# Altium schematic sheet Schematic R1.SchDoc
size A3
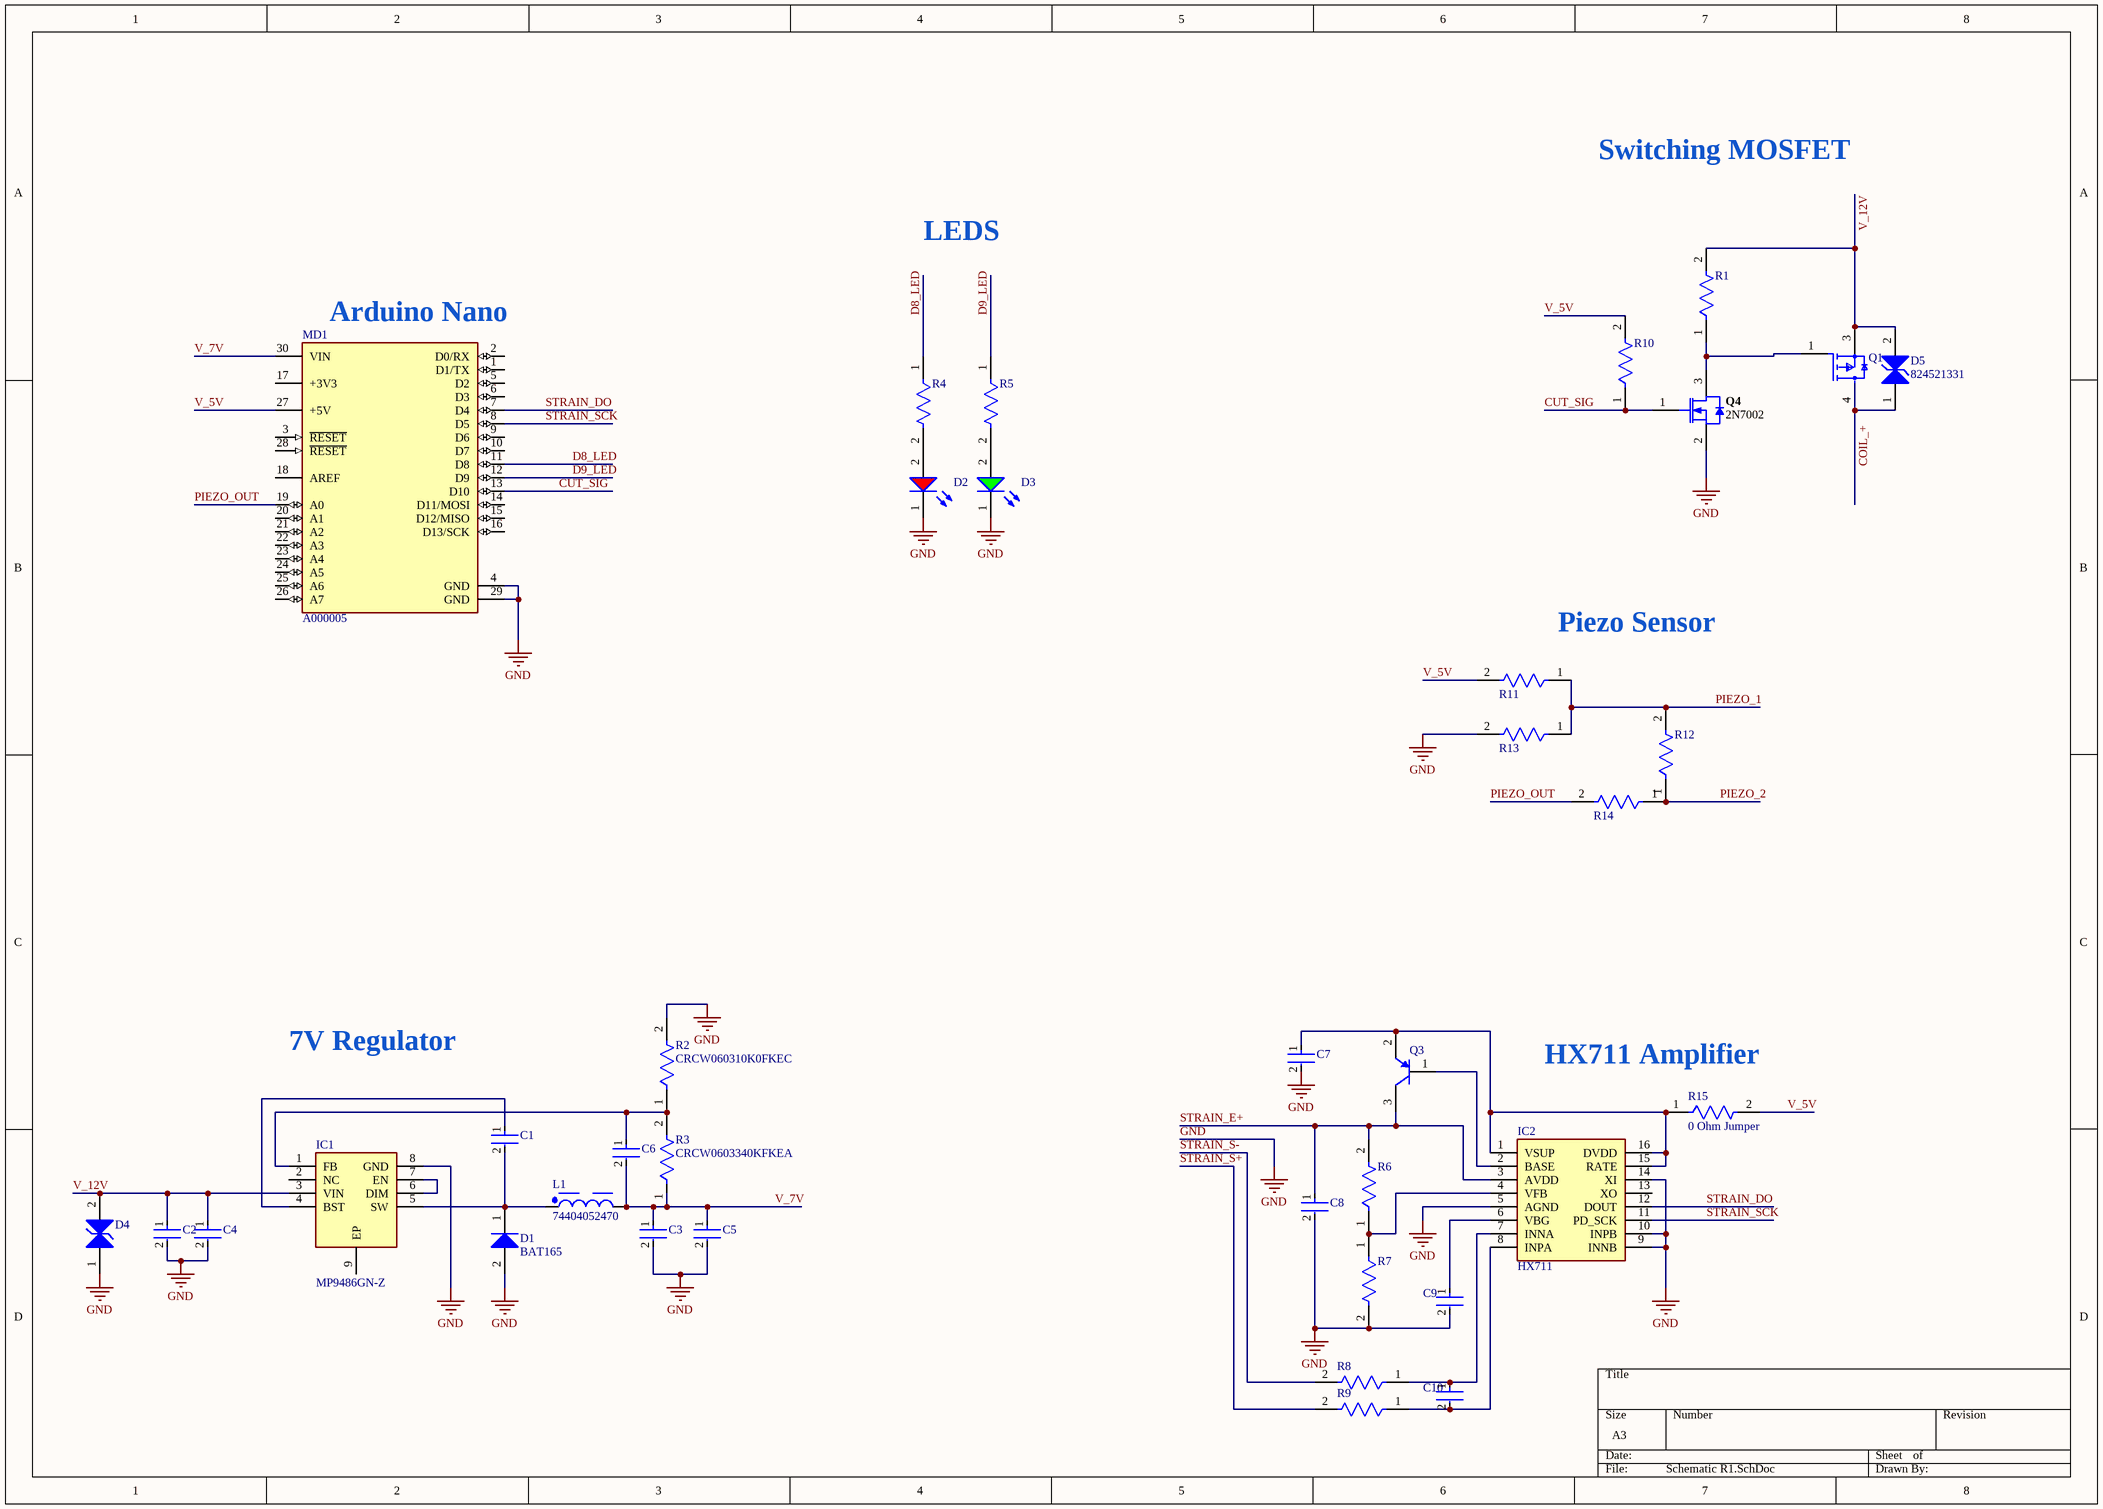
[diagram p0: Schematic R1.SchDoc]

## Parts
C1  C0603C104K3PACTU  [FP-C0603C-CF-MFG]  (value not drawn)
C2  C3216X5R1E476M160AC  [FP-C3216-160-0_2-MFG]  (value not drawn)
C3  C3216X5R1E476M160AC  [FP-C3216-160-0_2-MFG]  (value not drawn)
C4  C0603C104K3PACTU  [FP-C0603C-CF-MFG]  (value not drawn)
C5  C0603C225K4PACTU  [FP-C0603C225K4PACTU-MFG]  (value not drawn)
C6  C0603C104K3PACTU  [FP-C0603C-CF-MFG]  (value not drawn)
C7  C0603C106M8PACTU  [FP-C0603C106M8PACTU-MFG]  (value not drawn)
C8  C0603C106M8PACTU  [FP-C0603C106M8PACTU-MFG]  (value not drawn)
C9  C0603C104K3PACTU  [FP-C0603C-CF-MFG]  (value not drawn)
C10  C0603C104K3PACTU  [FP-C0603C-CF-MFG]  (value not drawn)
D1  BAT165  [INF-SOD323_V]
D2  150080RS75000  [WL-SMCW_0805_150080xx75000]  (value not drawn)
D3  150080GS75000  [WL-SMCW_0805_150080xx75000]  (value not drawn)
D4  824521331  [WE-TVSP_DO-214AA_Bidirectional]  (value not drawn)
D5  824521331  [WE-TVSP_DO-214AA_Bidirectional]
IC1  MP9486GN-Z  [SOIC127P600X170-9N]
IC2  HX711  [SOIC127P600X160-16N]
L1  74404052470  [WE-LQS_5020]
MD1  A000005  [FP-A000005-MFG]
Q1  SQM120P06-07L_GE3  [FP-T13-0707-MFG]  (value not drawn)
Q3  MMBT4403LT1G  [ONSC-SOT-23-3-318-08_V]  (value not drawn)
Q4  2N7002  [INF-PG-SOT23_M]
R1  CRCW060310K0FKEC  [FP-CRCW0603-e3-IPC_A]  (value not drawn)
R2  CRCW060310K0FKEC  [FP-CRCW0603-e3-IPC_A]
R3  CRCW0603340KFKEA  [FP-CRCW0603-e3-IPC_C]
R4  CRCW0603470RFKEA  [FP-CRCW0603-e3-MFG]  (value not drawn)
R5  CRCW0603470RFKEA  [FP-CRCW0603-e3-MFG]  (value not drawn)
R6  CRCW060310K0FKEC  [FP-CRCW0603-e3-IPC_A]  (value not drawn)
R7  CRCW06038K20FKEC  [FP-CRCW0603-e3-IPC_B]  (value not drawn)
R8  CRCW0603100RFKEB  [FP-CRCW0603-e3-IPC_A]  (value not drawn)
R9  CRCW0603100RFKEB  [FP-CRCW0603-e3-IPC_A]  (value not drawn)
R10  CRCW060310K0FKEC  [FP-CRCW0603-e3-IPC_A]  (value not drawn)
R11  CRCW060310K0FKEC  [FP-CRCW0603-e3-IPC_A]  (value not drawn)
R12  CRCW060310M0JNEA  [FP-CRCW0603-e3-IPC_A]  (value not drawn)
R13  CRCW060310K0FKEC  [FP-CRCW0603-e3-IPC_A]  (value not drawn)
R14  CRCW060310K0FKEC  [FP-CRCW0603-e3-IPC_A]  (value not drawn)
R15  0 Ohm Jumper  [FP-CRCW0603-HPe3-IPC_B]

## Nets
GND: C2.2 C3.2 C4.2 C5.2 C7.2 C8.2 C9.2 D1.2(A) D2.1(K) D3.1(K) D4.1 IC1.8(GND) IC2.5(AGND) IC2.9(INNB) IC2.10(INPB) IC2.14(XI) MD1.4(GND) MD1.29(GND) Q4.2(SOURCE) R2.2 R7.2 R13.2
COIL_+: D5.1 Q1.4(D)
CUT_SIG: MD1.13(D10) Q4.1(GATE) R10.1
D8_LED: MD1.11(D8) R4.1
D9_LED: MD1.12(D9) R5.1
PIEZO_1: R11.1 R12.2 R13.1
PIEZO_2: R12.1 R14.1
PIEZO_OUT: MD1.19(A0) R14.2
STRAIN_DO: IC2.12(DOUT) MD1.7(D4)
STRAIN_E+: C8.1 IC2.3(AVDD) Q3.3(C) R6.2
STRAIN_S+: R9.2
STRAIN_S-: R8.2
STRAIN_SCK: IC2.11(PD_SCK) MD1.8(D5)
V_5V: MD1.27(+5V) R10.2 R11.2 R15.2
V_7V: C3.1 C5.1 C6.2 L1.2 MD1.30(VIN) R3.1
V_12V: C2.1 C4.1 D4.2 D5.2 IC1.3(VIN) Q1.3(S) R1.2
NetC1_1: C1.1 IC1.4(BST)
NetC1_2: C1.2 D1.1(K) IC1.5(SW) L1.1
NetC6_1: C6.1 IC1.1(FB) R2.1 R3.2
NetC7_1: C7.1 IC2.1(VSUP) IC2.15(RATE) IC2.16(DVDD) Q3.2(E) R15.1
NetC9_1: C9.1 IC2.6(VBG)
NetC10_1: C10.1 IC2.7(INNA) R8.1
NetC10_2: C10.2 IC2.8(INPA) R9.1
NetD2_2: D2.2(A) R4.2
NetD3_2: D3.2(A) R5.2
NetIC1_6: IC1.6(DIM) IC1.7(EN)
NetIC2_2: IC2.2(BASE) Q3.1(B)
NetIC2_4: IC2.4(VFB) R6.1 R7.1
NetQ1_1: Q1.1(G) Q4.3(DRAIN) R1.1

Not connected (* = marked no-connect by the designer): IC1 2(NC) 9(EP); IC2 13(XO); MD1 1(D1/TX) 2(D0/RX) 3(~{RESET}) 5(D2) 6(D3) 9(D6) 10(D7) 14(D11/MOSI) 15(D12/MISO) 16(D13/SCK) 17(+3V3) 18(AREF) 20(A1) 21(A2) 22(A3) 23(A4) 24(A5) 25(A6) 26(A7) 28(~{RESET})

## Notes on the sheet
- Switching MOSFET
- LEDS
- (near MD1) Arduino Nano
- (near R11) Piezo Sensor
- 7V Regulator
- (near R15) HX711 Amplifier

## Library data of the parts
C1 C4 C6 C9 C10 = CMP-03020-000352-2: C0603 0.10 μF X5R 30ppm/°C 10.00% 25 V; Manufacturer: KEMET; Tolerance: 0.1; Material: Ceramic; Voltage Rating: 25 V; Value: 0.10 μF; Automotive Grade: Grade 1; Temperature Range High: +125°C; Temperature: -55°C to +125°C; Package: C0603C-CF; ComponentLink2URL: https://api.kemet.com/component-edge/download/datasheet/C0603C100J5GACAUTO.pdf; Device Class L1: Passive Components; ComponentLink2Description: Datasheet; Device Class L3: Ceramic Capacitors; Manufacturer Part Number: C0603C104K3PACTU; Lead Free: Yes; RoHS: TRUE; Temperature Characteristic: X5R; Category: Cap; Automotive: Yes; Device Class L2: Capacitors; Mouser Description: Multilayer Ceramic Capacitors MLCC - SMD/SMT 25volts 0.1uF 10% X5R; Capacitance: 0.10 μF; Temperature Coefficient: 30ppm/°C; Octopart: https://octopart.com/c0603c104k3pactu-kemet-19022554; Temperature Range Low: -55°C; Height: 0.87mm
C2 C3 = CMP-2000-05397-3: Multilayer Ceramic Capacitors 47uF ±20% 25V X5R SMD 1206; Weight: 0.000571oz; Dielectric: X5R; Length: 0.126inch; Voltage Rating: 25V; Case/Package: 1206; Dielectric Material: Ceramic; Min Operating Temperature: -55°C; Lead Free: Lead Free; Packaging: Tape and Reel; Package Quantity: 1; Mount: Surface Mount; Depth: 1.6mm; REACH SVHC: No SVHC; Termination: SMD/SMT; Case Code (Imperial): 1206; Series: C; Resistor Type: Ceramic; Voltage: 25V; Width: 0.063inch; Height: 1.6mm; Tolerance: 20%; Capacitance: 47uF; Max Operating Temperature: 85°C; Voltage Rating (DC): 25V; RoHS Compliant: Yes; Thickness: 0.071inch; Case Code (Metric): 3216
C5 = CMP-2006-02259-2: CAP CER 2.2UF 16V X5R 0603; Dielectric Material: Ceramic; Tolerance: 10%; Dissipation Factor: 5%; Series: C; Voltage Rating (DC): 16V; REACH SVHC: No SVHC; RoHS Compliant: Yes; Number of Pins: 2; Max Operating Temperature: 85°C; Voltage Rating: 16V; Min Operating Temperature: -55°C; Termination: SMD/SMT; Dielectric: X5R; Packaging: Tape and Reel; Contact Plating: Tin; Case Code (Metric): 1608; Height: 0.8mm; Capacitance: 2.2uF; Case/Package: 0603; Width: 0.8mm; Construction: Flat; Depth: 0.8mm; Thickness: 0.034inch; Radiation Hardening: No; Length: 1.6mm; Mount: Surface Mount; Case Code (Imperial): 0603; Voltage: 16V; Package Quantity: 1; Lead Free: Lead Free
C7 C8 = CMP-03020-034654-1: CAP CER 10UF 10V X5R 0603; RoHS Compliant: Yes
D1 = CMP-1183-00004-1: Medium Power AF Schottky Diode, SOD323, Reel, Green; Manufacturer: Infineon; IF (max): 750Â mA; VF (max): 700Â mV; VR (max): 40Â V; CT (max): 12Â pF; Configuration: Single; Green: TRUE; ComponentLink3URL: http://www.infineon.com/dgdl/SOD323-Package_Overview.pdf?folderId=db3a30431936bc4b011952aab84f3bbe&fileId=db3a30431936bc4b011952beed653be3; PackageReference: SOD323; ComponentLink1URL: http://www.infineon.com/; PartNumber: BAT165; Mounting Technology: Surface Mount; PackageDescription: 2-Pin Small Outline Diode Package, 1.25 x 1.7 mm Body; ComponentLink1Description: Manufacturer URL; ComponentLink3Description: Package Specification; ComponentLink2URL: http://www.infineon.com/dgdl/bat165series.pdf?folderId=db3a304313d846880113def5812204a1&fileId=db3a304313d846880113df01f69804d6; Packing: Reel; ComponentLink2Description: Datasheet
D2 = CMP-1426-00011-2: NexarPartId: 29717781; Peak Wavelength: 630nm; Wavelength: 625nm; Viewing Angle: 140°; Test Current: 20mA; Forward Voltage: 2V; Forward Current: 100mA; Lens Style: Clear, Rectangular; Color: Red; Luminous Intensity: 150mcd; Max Reverse Voltage (DC): 5V; Length: 2mm; Case Code (Imperial): 0805; RoHS: Compliant; Max Operating Temperature: 85°C; Height: 700µm; Packaging: Tape and Reel; Case/Package: 0805; REACH SVHC: Unknown; Dominant Wavelength: 625nm; Min Operating Temperature: -40°C; Case Code (Metric): 2012; Mount: Surface Mount; Width: 1.25mm
D3 = CMP-1426-00007-2: NexarPartId: 29717780; Wavelength: 520nm; Forward Current: 100mA; Lens Style: Clear, Rectangular; Dominant Wavelength: 525nm; Max Junction Temperature (Tj): 95°C; Power Dissipation: 105mW; Luminous Intensity: 450mcd; Peak Wavelength: 515nm; Color: Green; Viewing Angle: 140°; Test Current: 20mA; Reverse Voltage: 5V; Forward Voltage: 3.2V; Mount: Surface Mount; REACH SVHC: Unknown; Min Operating Temperature: -40°C; Case Code (Imperial): 0805; Case/Package: 0805; Max Operating Temperature: 85°C; RoHS: Compliant; Length: 2mm; Height: 700µm; Width: 1.25mm; Case Code (Metric): 2012; Packaging: Tape and Reel; Max Reverse Voltage (DC): 5V
D4 D5 = CMP-03913-71101627-1: 824521331 TVS diode [Würth Elektronik] 824521331 TVS diode; Min Breakdown Voltage: 38.65V; Peak Pulse Current: 11.3A; Power Line Protection: No; Reverse Standoff Voltage: 33V; Peak Pulse Power: 600W; Number of Bidirectional Channels: 1; Leakage Current: 1µA; Polarity: Bidirectional; Clamping Voltage: 53.3V; REACH SVHC: Unknown; NexarPartId: 71101627; Packaging: Cut Tape; Min Operating Temperature: -65°C; Height: 2.4mm; Max Operating Temperature: 150°C; Width: 3.62mm; Number of Pins: 2; RoHS: Compliant; Length: 4.32mm; Mount: Surface Mount; Breakdown Voltage: 38.65V; Max Breakdown Voltage: 38.65V; Composition: Zener
IC1 = MP9486GN-Z: Integrated Circuit; Manufacturer_Name: Monolithic Power Systems (MPS); Datasheet Link: https://www.monolithicpower.com/en/documentview/productdocument/index/version/2/document_type/Datasheet/lang/en/sku/MP9486/; Height: 1.7mm; Manufacturer_Part_Number: MP9486GN-Z; Mouser Part Number: 946-MP9486GN-Z; Mouser Price/Stock: https://www.mouser.co.uk/ProductDetail/Monolithic-Power-Systems-MPS/MP9486GN-Z?qs=YCa%2FAAYMW039h5ckyQnXtA%3D%3D
IC2 = HX711: Integrated Circuit; Manufacturer_Name: AVIA; Datasheet Link: https://cdn.sparkfun.com/datasheets/Sensors/ForceFlex/hx711_english.pdf; Height: 1.6mm; Manufacturer_Part_Number: HX711
L1 = CMP-03913-61645225-1: 74404052470 Inductors, Fixed, WE-LQS SMD 5020 47uH 0.8A 521mOhms; Shielding: Shielded; Self Resonant Frequency: 11MHz; Test Frequency: 100kHz; DC Resistance (DCR): 521mΩ; Inductance: 47µH; Saturation Current: 950mA; Tolerance: 20%; Current Rating: 800mA; RoHS: Compliant; Height: 2mm; Packaging: Tape & Reel (TR); Height - Seated (Max): 2.0066mm; Min Operating Temperature: -40°C; Mount: Surface Mount; Length: 5mm; Max Operating Temperature: 125°C; Case/Package: Nonstandard; Ambient Temperature Range High: 85°C; NexarPartId: 61645225; Inductance Tolerance: 20%; Composition: Wirewound; Ambient Temperature Range Low: -40°C; Width: 5mm
MD1 = CMP-189986-000002-1: ARDUINO NANO ATMEGA328 EVAL BRD; Number of Bits: 8; Evaluation Kit: Yes; Operating Supply Voltage: 12V; Interface: I2C; Data Bus Width: 8b; Core Architecture: AVR; Packaging: Bulk; Length: 7inch; Package Quantity: 50; Width: 5inch; REACH SVHC: No SVHC; Weight: 0.358383oz; Series: AVR® ATmega; Height: 0.25inch
Q1 = CMP-02550-000035-1: MOSFET P-CH 60V 120A TO263; Manufacturer: Vishay; Max Junction Temp: +175°C; Rthja Max: 40°C/W; Max Forward Diode Voltage: -1.5V; Turn On Delay Time: 15ns; Number Of P Channels: 1; Drain To Source Resistance: 0.0056Ω; Gate To Source Voltage: 20V; Drain To Source Voltage: -60V; Power Dissipation: 375W; Pulse Drain Current: -480A; Automotive Grade: Grade 0; Transconductance: 90S; Continuous Drain Current: -120A; Gate Charge At Vgs: 180nC @ -10V; Standoff Height: 0.254mm; Threshold Vgs Max: -2.5V; Typ Forward Diode Voltage: -0.95V; Input Capacitace At Vds: 11423pF @ -25V; Depletion Mode: False; Turn Off Delay Time: 97ns; Automotive: Yes; RoHS: TRUE; Threshold Vgs Min: -1.5V; ComponentLink2Description: Datasheet; ComponentLink2URL: http://www.vishay.com/docs/67026/sqm120p0.pdf; Device Class L3: MOSFETs; Height: 5.08mm; Digikey Description: MOSFET P-CH 60V 120A TO263; Category: Trans; Device Class L2: Transistors; Package: T13-0707; Device Class L1: Discrete Semiconductors; Drain To Source Breakdown Voltage: -60V; Manufacturer Part Number: SQM120P06-07L_GE3; Temperature Range Low: -55°C; Temperature: -55°C to +175°C; Octopart: https://octopart.com/sqm120p06-07l_ge3-vishay-61925110; Temperature Range High: +175°C; Lead Free: Yes; Number Of Channels: 1
Q3 = CMP-1048-00539-1: Switching Transistor, PNP Silicon, 3-Pin SOT-23, Pb-Free, Tape and Reel; Manufacturer: On Semiconductor; fT Min (MHz): 200; IC Continuous (A): -0.6; ComponentLink1URL: http://www.onsemi.com/; ComponentLink2URL: http://www.onsemi.cn/pub_link/Collateral/MMBT4403LT1-D.PDF; PackageVersion: Rev. AP, 11/2009; ComponentLink1Description: Manufacturer URL; PackageDescription: 3-Pin Small Outline Transistor, Body 2.92 x 1.3 mm, Pitch 0.95 mm; Polarity: PNP; ComponentLink3Description: Package Specification; DatasheetVersion: Rev. 12; Mounting Technology: Surface Mount; PackageReference: SOT-23-3-318-08; ComponentLink3URL: http://www.onsemi.cn/pub_link/Collateral/318-08.PDF; Packing: Tape and Reel; PartNumber: MMBT4403LT1G; RoHS: TRUE; ComponentLink2Description: Datasheet
Q4 = CMP-1149-00026-1: N-Channel OptiMOS Small-Signal-Transistor, 60 V VDS, 0.3 A ID, -55 to 150 degC, PG-SOT23, Reel, Green; Manufacturer: Infineon; RDS (on) (max) (@4.5V): 4,000 mOhm; VDS (max): 60 V; IDpuls (max): 1.2Â A; QG: 0.4Â nC; RDS (on) (max): 3,000 mOhm; RthJA (max): 250 K/W; ID (max): 0.3Â A; VGS(th) (max): 2.5Â V; VGS(th) (min): 1.5Â V; Green: TRUE; Ptot (max): 0.5Â W; PackageDescription: 3-Pin Small Outline Transistor Package, 2.9 x 1.3 mm Body, 0.95 mm Pitch; Halogen-free: TRUE; ComponentLink2Description: Datasheet; ComponentLink1URL: http://www.infineon.com/; Packing: Reel; DatasheetVersion: Rev. 2.4; PartNumber: 2N7002; PackageReference: PG-SOT23; PackageVersion: Apr-08; ComponentLink3URL: http://www.infineon.com/dgdl/SOT23-Package_Overview.pdf?folderId=db3a30431936bc4b0119532290053c66&fileId=db3a30431936bc4b0119533468123c85; ComponentLink1Description: Manufacturer URL; Mounting Technology: Surface Mount; ComponentLink3Description: Package Specification; ComponentLink2URL: http://www.infineon.com/dgdl/2N7002_Rev2.4.pdf?folderId=db3a3043156fd573011622e10b5c1f67&fileId=db3a304319bc939a0119c2a9461e79e6
R1 R2 R6 R10 R11 R13 R14 = CMP-02407-006151-1: RES Thick Film, 10kΩ, 1%, 0.1W, 100ppm/°C, 0603; Max Power Dissipation: 100mW; Resistance: 10kR; Radiation Hardening: No; Height: 0.02inch; Case Code (Metric): 1608; Case/Package: 0603; Case Code (Imperial): 0603; Lead Free: Lead Free; Tolerance: 1%; Number of Terminations: 2; Width: 0.033inch; Temperature Coefficient: 100ppm/°C; Length: 0.061inch; Max Operating Temperature: 155°C; Contact Plating: Tin; Depth: 0.85mm; Packaging: Tape and Reel; Composition: Thick Film; Power Rating: 100mW; Military Standard: Not; Min Operating Temperature: -55°C; Features: Automotive AEC-Q200
R3 = CMP-1012-00795-3: RES Thick Film, 340kΩ, 1%, 0.1W, 100ppm/°C, 0603; Max Power Dissipation: 100mW; Voltage Rating (DC): 75V; Resistance: 340kR; Termination: SMD/SMT; Number of Terminations: 2; Number of Pins: 2; Case/Package: 0603; Package Quantity: 10; Depth: 0.85mm; Temperature Coefficient: 100ppm/°C; Radiation Hardening: No; Packaging: Tape and Reel; Lead Free: Lead Free; Case Code (Imperial): 0603; Width: 0.033inch; Features: Automotive AEC-Q200; Voltage Rating: 75V; Max Operating Temperature: 155°C; Contact Plating: Tin; Min Operating Temperature: -55°C; Tolerance: 1%; Composition: Thick Film; Length: 1.55mm; Weight: 7.1E-05oz; Case Code (Metric): 1608; Military Standard: Not; Height: 0.02inch; Power Rating: 100mW
R4 R5 = CMP-2000-03373-2: RES Thick Film, 470Ω, 1%, 0.1W, 100ppm/°C, 0603; Voltage Rating: 75V; Resistance: 470R; Max Power Dissipation: 100mW; Lead Free: Lead Free; Weight: 7.1E-05oz; Composition: Thick Film; Case Code (Imperial): 0603; Height: 0.45mm; Width: 0.033inch; Case/Package: 0603; Package Quantity: 10; Temperature Coefficient: 100ppm/°C; Min Operating Temperature: -55°C; Case Code (Metric): 1608; Radiation Hardening: No; Mount: Surface Mount; Tolerance: 1%; Depth: 0.85mm; Power Rating: 100mW; Length: 1.55mm; Voltage Rating (DC): 75V; Number of Terminations: 2; Contact Plating: Tin; Packaging: Tape and Reel; Termination: SMD/SMT; Features: Automotive AEC-Q200; Max Operating Temperature: 155°C; Military Standard: Not
R7 = CMP-02407-002238-1: RES Thick Film, 8.2kΩ, 1%, 0.1W, 100ppm/°C, 0603; Max Power Dissipation: 100mW; Resistance: 8.2kR; Max Operating Temperature: 155°C; Package Quantity: 20000; Height: 0.02inch; Radiation Hardening: No; Depth: 0.85mm; Lead Free: Lead Free; Packaging: Tape and Reel; Features: Automotive AEC-Q200; Length: 0.061inch; Military Standard: Not; Min Operating Temperature: -55°C; Temperature Coefficient: 100ppm/°C; Contact Plating: Tin; Number of Terminations: 2; Tolerance: 1%; Case/Package: 0603; Composition: Thick Film; Width: 0.033inch
R8 R9 = CMP-2000-03825-2: RES Thick Film, 100Ω, 1%, 0.1W, 100ppm/°C, 0603; Voltage Rating (DC): 75V; Power Rating: 100mW; Resistance: 100R; Case Code (Imperial): 0603; Case/Package: 0603; Composition: Thick Film; Military Standard: Not; Number of Terminations: 2; Packaging: Tape and Reel; Depth: 0.85mm; Height: 0.02inch; Features: Automotive AEC-Q200; Width: 0.033inch; Lead Free: Lead Free; Contact Plating: Tin; Package Quantity: 10000; Length: 1.55mm; Tolerance: 1%; Temperature Coefficient: 100ppm/°C; Max Operating Temperature: 155°C; Weight: 7.1E-05oz; Voltage Rating: 75V; Radiation Hardening: No; Max Power Dissipation: 100mW; Termination: SMD/SMT; Min Operating Temperature: -55°C; Case Code (Metric): 1608
R12 = CMP-2000-03844-2: RES Thick Film, 10MΩ, 5%, 0.1W, 200ppm/°C, 0603; Power Rating: 100mW; Voltage Rating: 75V; Resistance: 10MR; Packaging: Tape and Reel; Features: Automotive AEC-Q200; Depth: 0.85mm; Termination: SMD/SMT; Max Operating Temperature: 155°C; Min Operating Temperature: -55°C; Number of Pins: 2; Tolerance: 5%; Height: 0.02inch; Length: 1.55mm; Case Code (Metric): 1608; Lead Free: Lead Free; Case Code (Imperial): 0603; Military Standard: Not; Temperature Coefficient: 200ppm/°C; Number of Terminations: 2; Width: 0.85mm; Voltage Rating (DC): 75V; Case/Package: 0603; Contact Plating: Tin; Weight: 7.1E-05oz; Package Quantity: 1; Max Power Dissipation: 100mW; Composition: Thick Film
R15 = CMP-02407-004162-1: RES Thick Film, 0Ω, 5%, 0.33W, 200ppm/°C, 0603